# Altium schematic sheet SCH-HC15C_REV1_PG1.SchDoc: MODEL: HC 15C
size 863 x 558 mm; DocumentNumber: SCH-HC15C; SheetNumber: 1; SheetTotal: 3; Title2: HAB'S 1ST GEN CALCULATOR
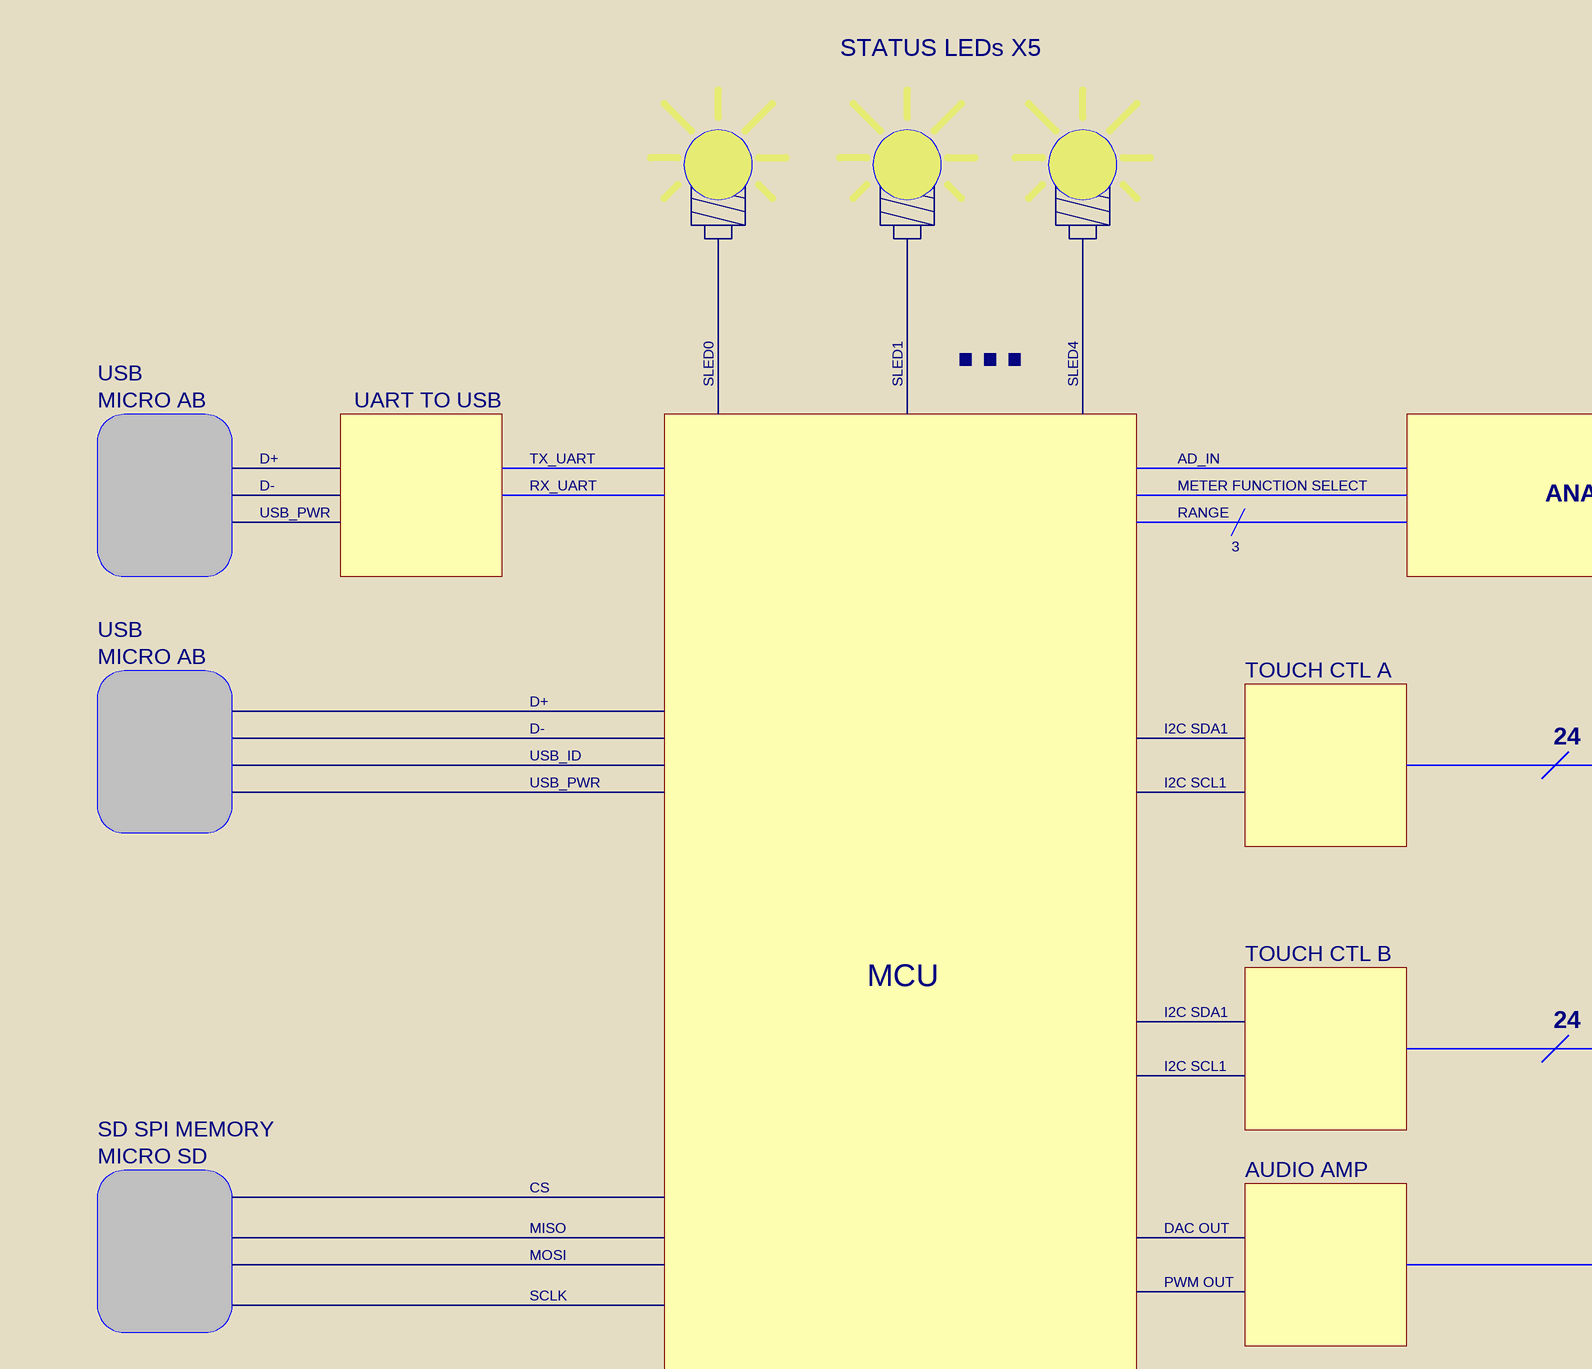
[diagram p0: SCH-HC15C_REV1_PG1.SchDoc, top left]
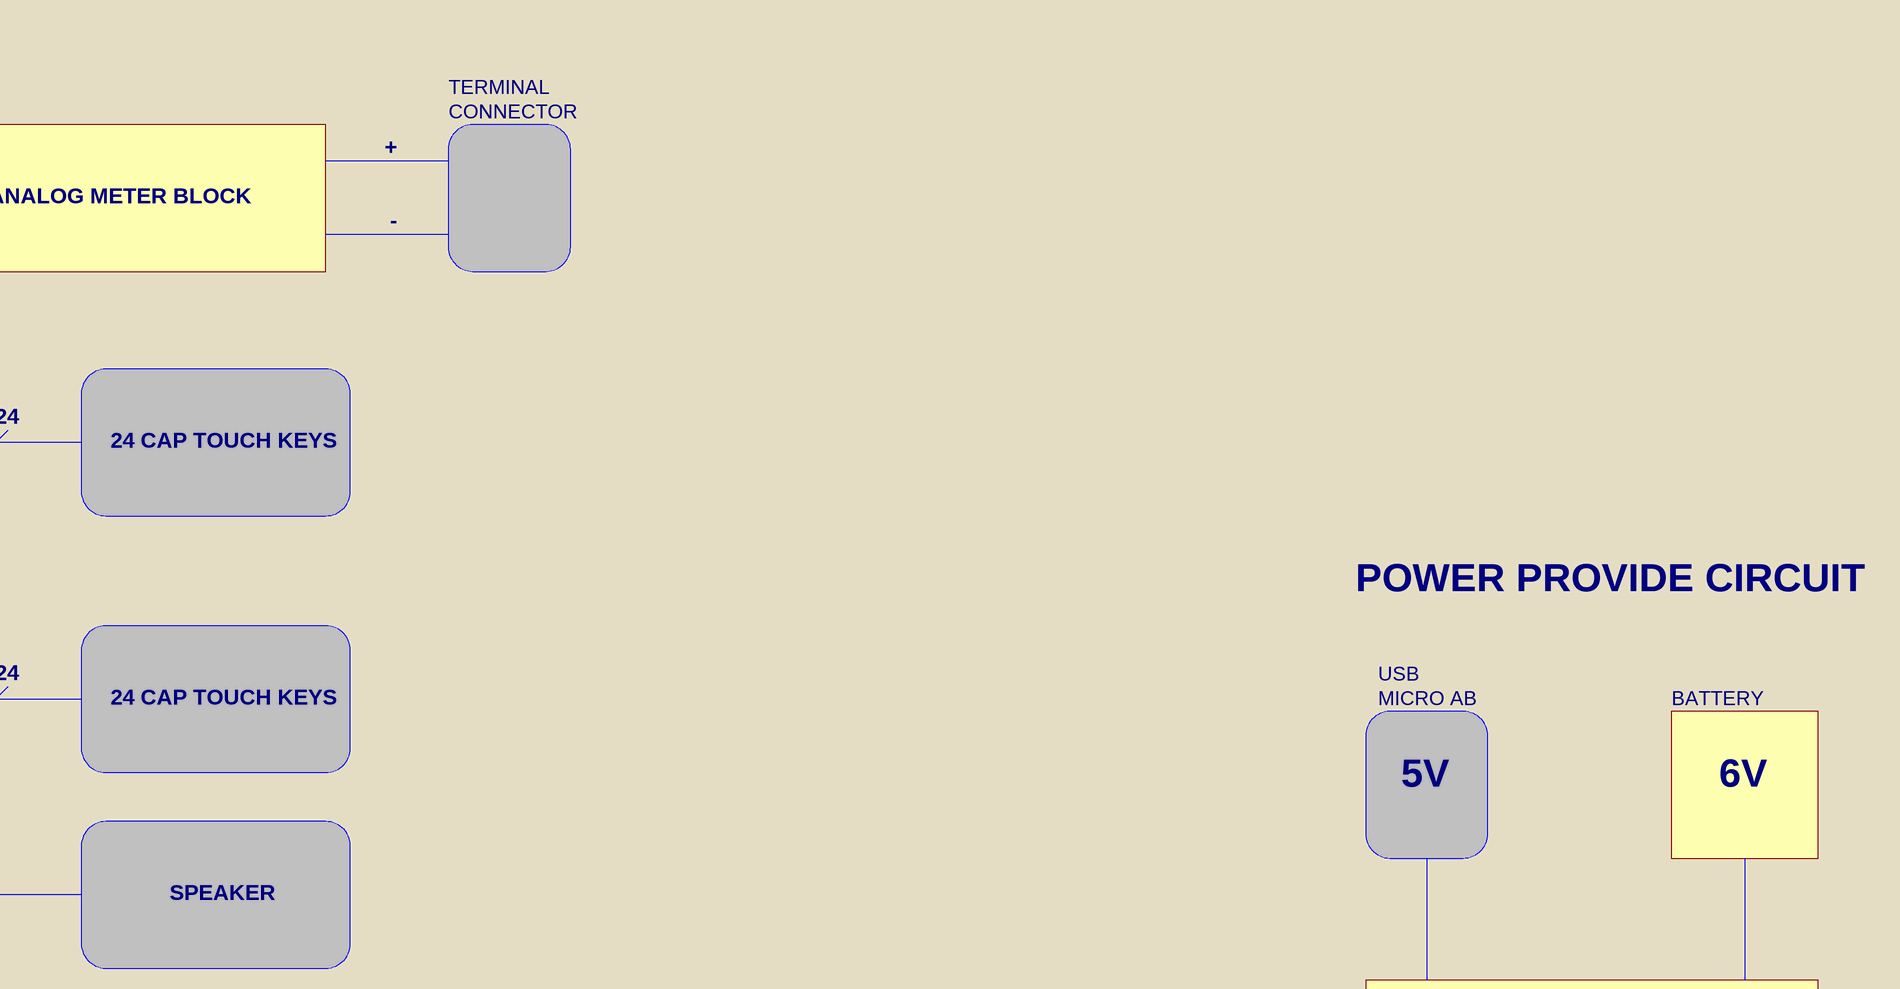
[diagram p1: SCH-HC15C_REV1_PG1.SchDoc, top right]
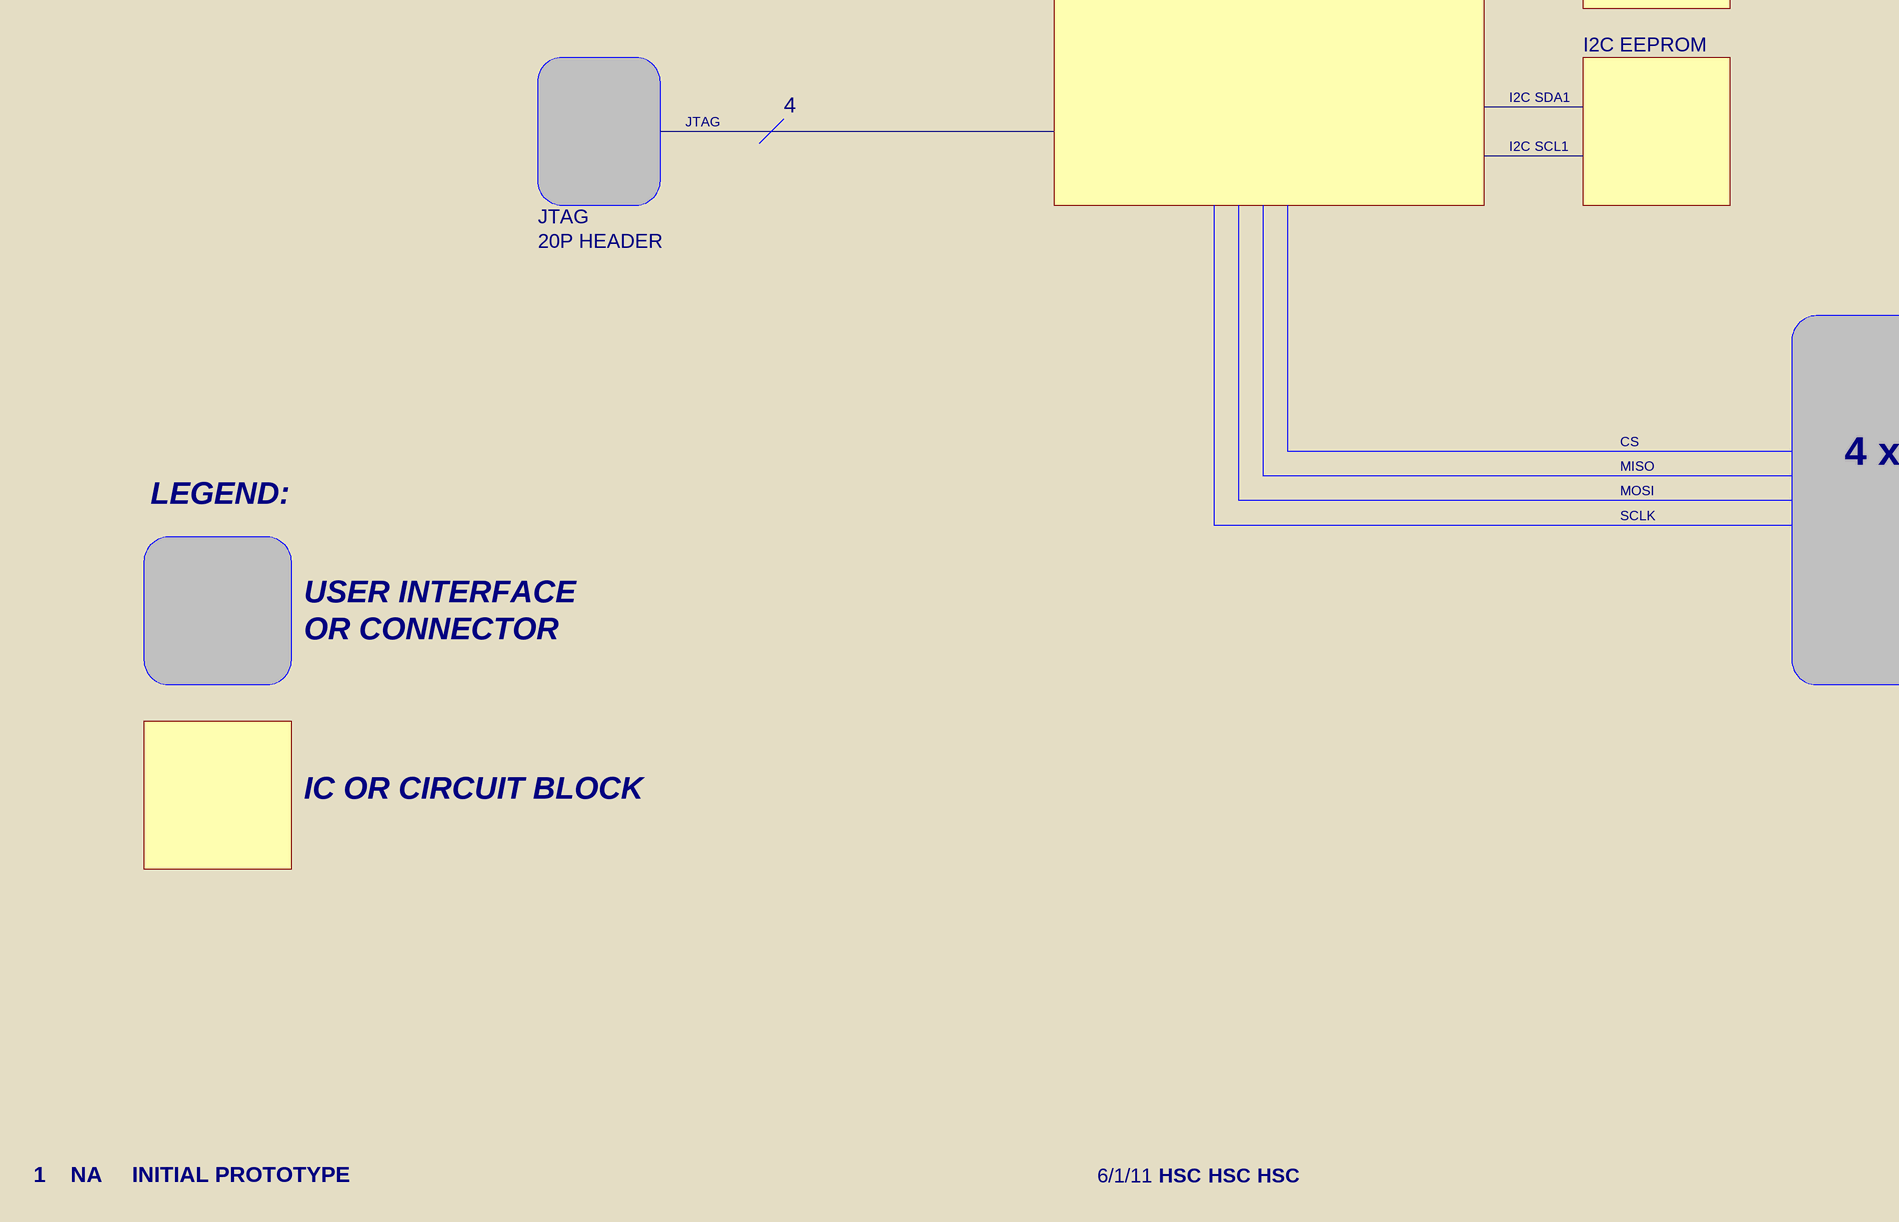
[diagram p2: SCH-HC15C_REV1_PG1.SchDoc, bottom left]
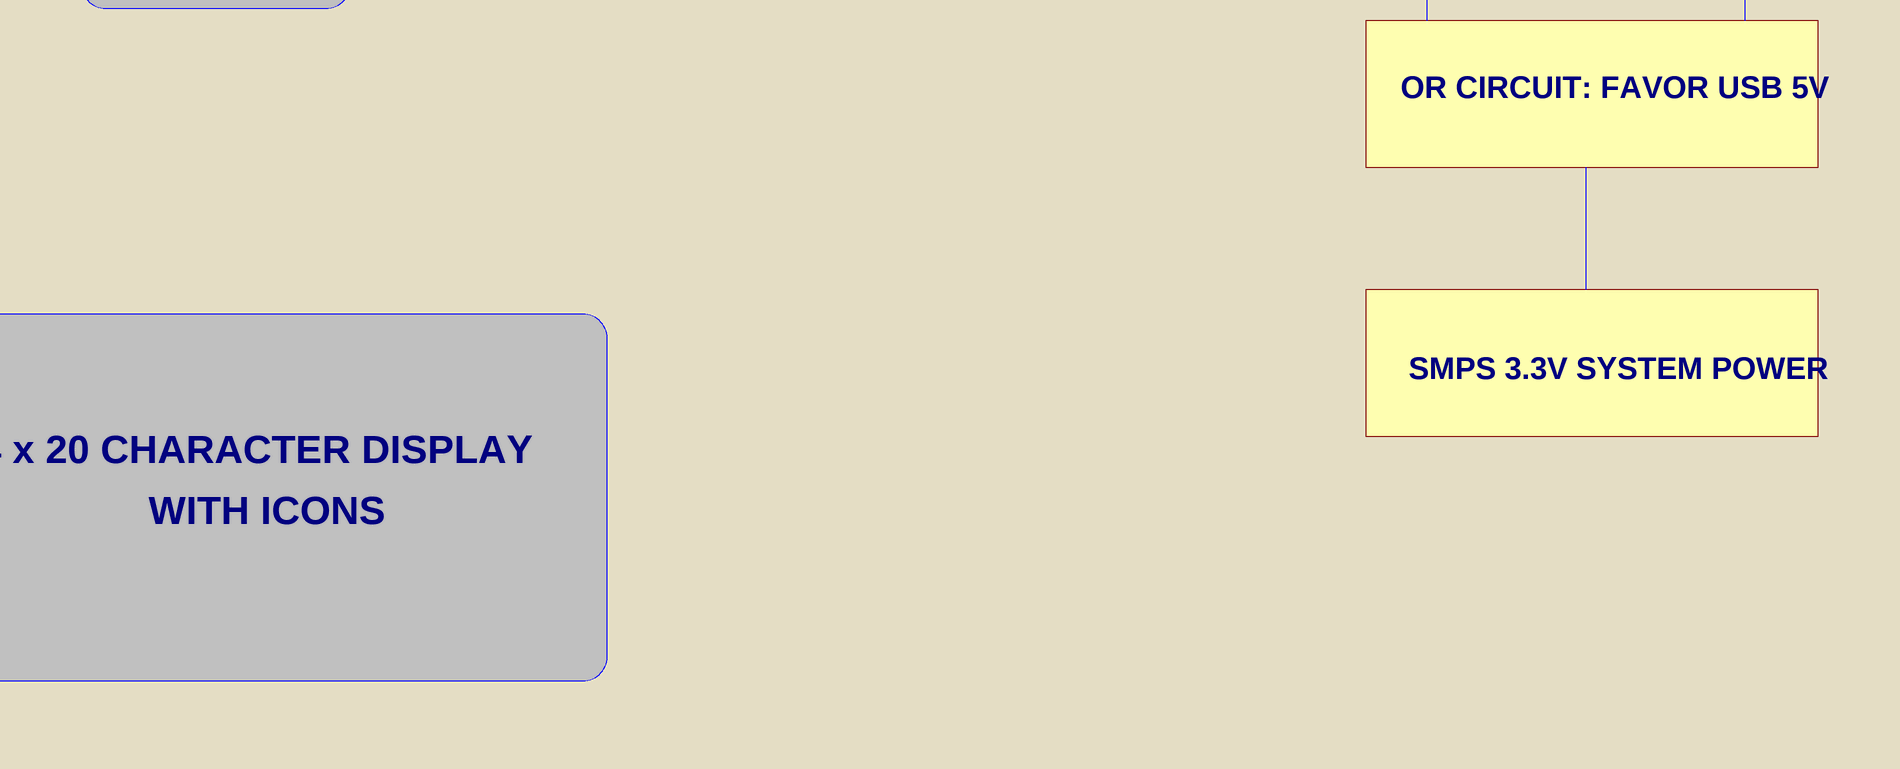
[diagram p3: SCH-HC15C_REV1_PG1.SchDoc, bottom right]

## Notes on the sheet
- STATUS LEDs X5
- MICRO AB
- USB
- UART TO USB
- SLED0
- SLED1
- ...
- SLED4
- CONNECTOR
- TERMINAL
- D+
- D-
- TX_UART
- RX_UART
- AD_IN
- METER FUNCTION SELECT
- +
- USB_PWR
- RANGE
- 3
- ANALOG METER BLOCK
- -
- TOUCH CTL A
- USB_ID
- I2C SDA1
- 24
- I2C SCL1
- 24 CAP TOUCH KEYS
- TOUCH CTL B
- POWER PROVIDE CIRCUIT
- MCU
- BATTERY
- SD SPI MEMORY
- MICRO SD
- 5V
- 6V
- MISO
- CS
- DAC OUT
- AUDIO AMP
- MOSI
- SCLK
- PWM OUT
- SPEAKER
- I2C EEPROM
- JTAG
- 4
- OR CIRCUIT: FAVOR USB 5V
- 20P HEADER
- SMPS 3.3V SYSTEM POWER
- LEGEND:
- 4 x 20 CHARACTER DISPLAY
- WITH ICONS
- USER INTERFACE
- OR CONNECTOR
- IC OR CIRCUIT BLOCK
- 1
- NA
- INITIAL PROTOTYPE
- 6/1/11
- HSC
- TITLE:
- SHEET:
- OF
- SCHEMATIC
- DRAWING #:
- 3621 GIN WAY
- CONYERS, GA 30039
- INFORMATION CONTAINED HEREIN IS THE PROPERTY OF Hab Collector
- DBA HabWorks AND IS TO BE HELD IN COMPLETE CONFIDENCE.
- PHONE: 678-687-0270
- FILENAME:
- FILETYPE:
- REV
- ECO#
- DESCRIPTION
- DATE
- DRW
- CHK
- APR
- REPRODUCE WITH WRITTEN CONSENT ONLY.
- ALTIUM